# EAGLE schematic TSOC_RS485_EM (EAGLE 6.6.0)
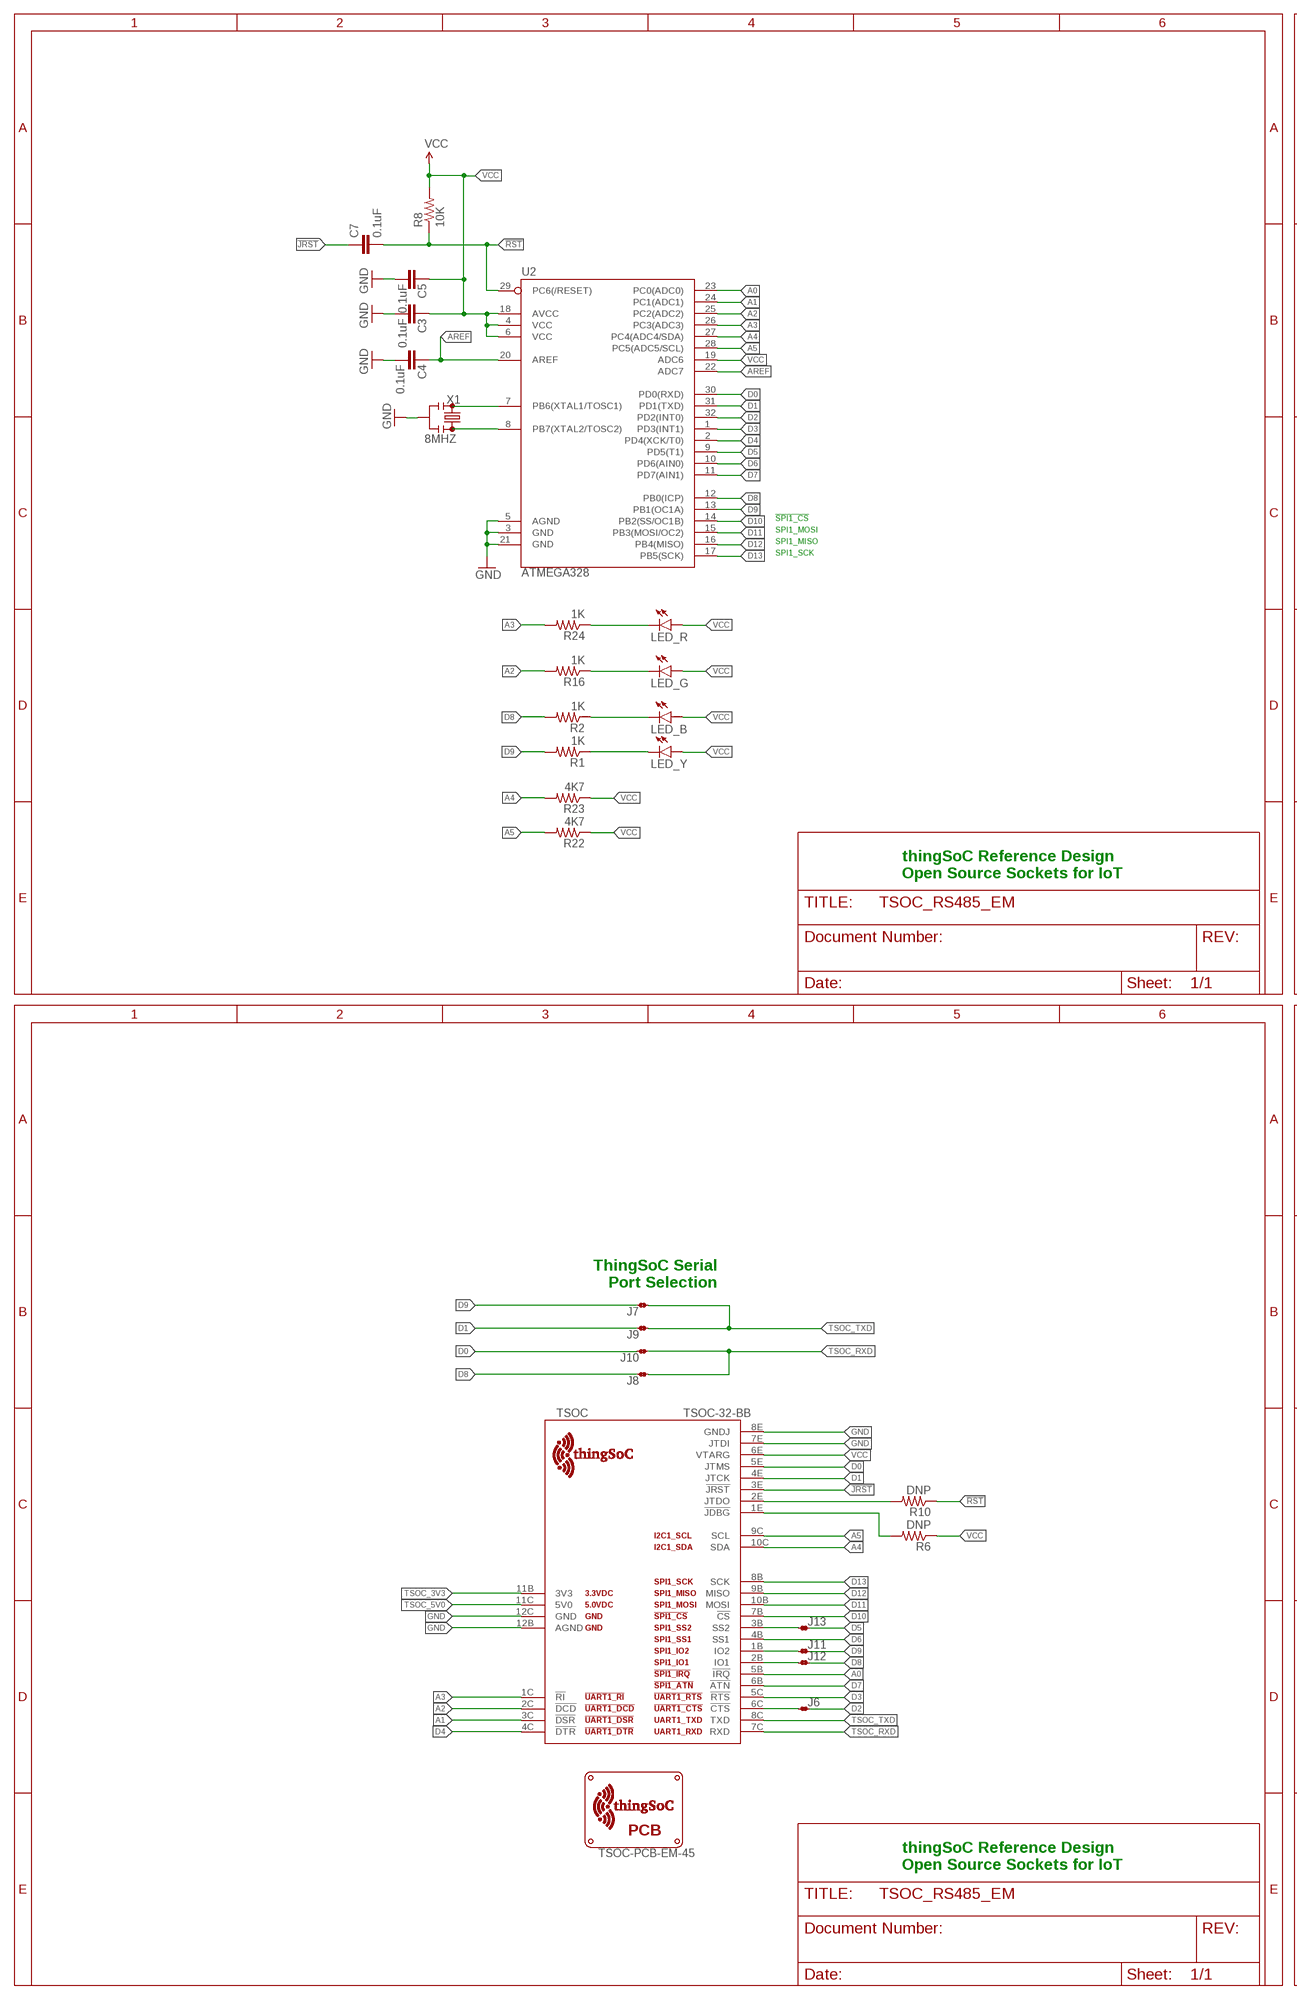
[diagram p0: schematic, sheet 1, part 1 of 2]
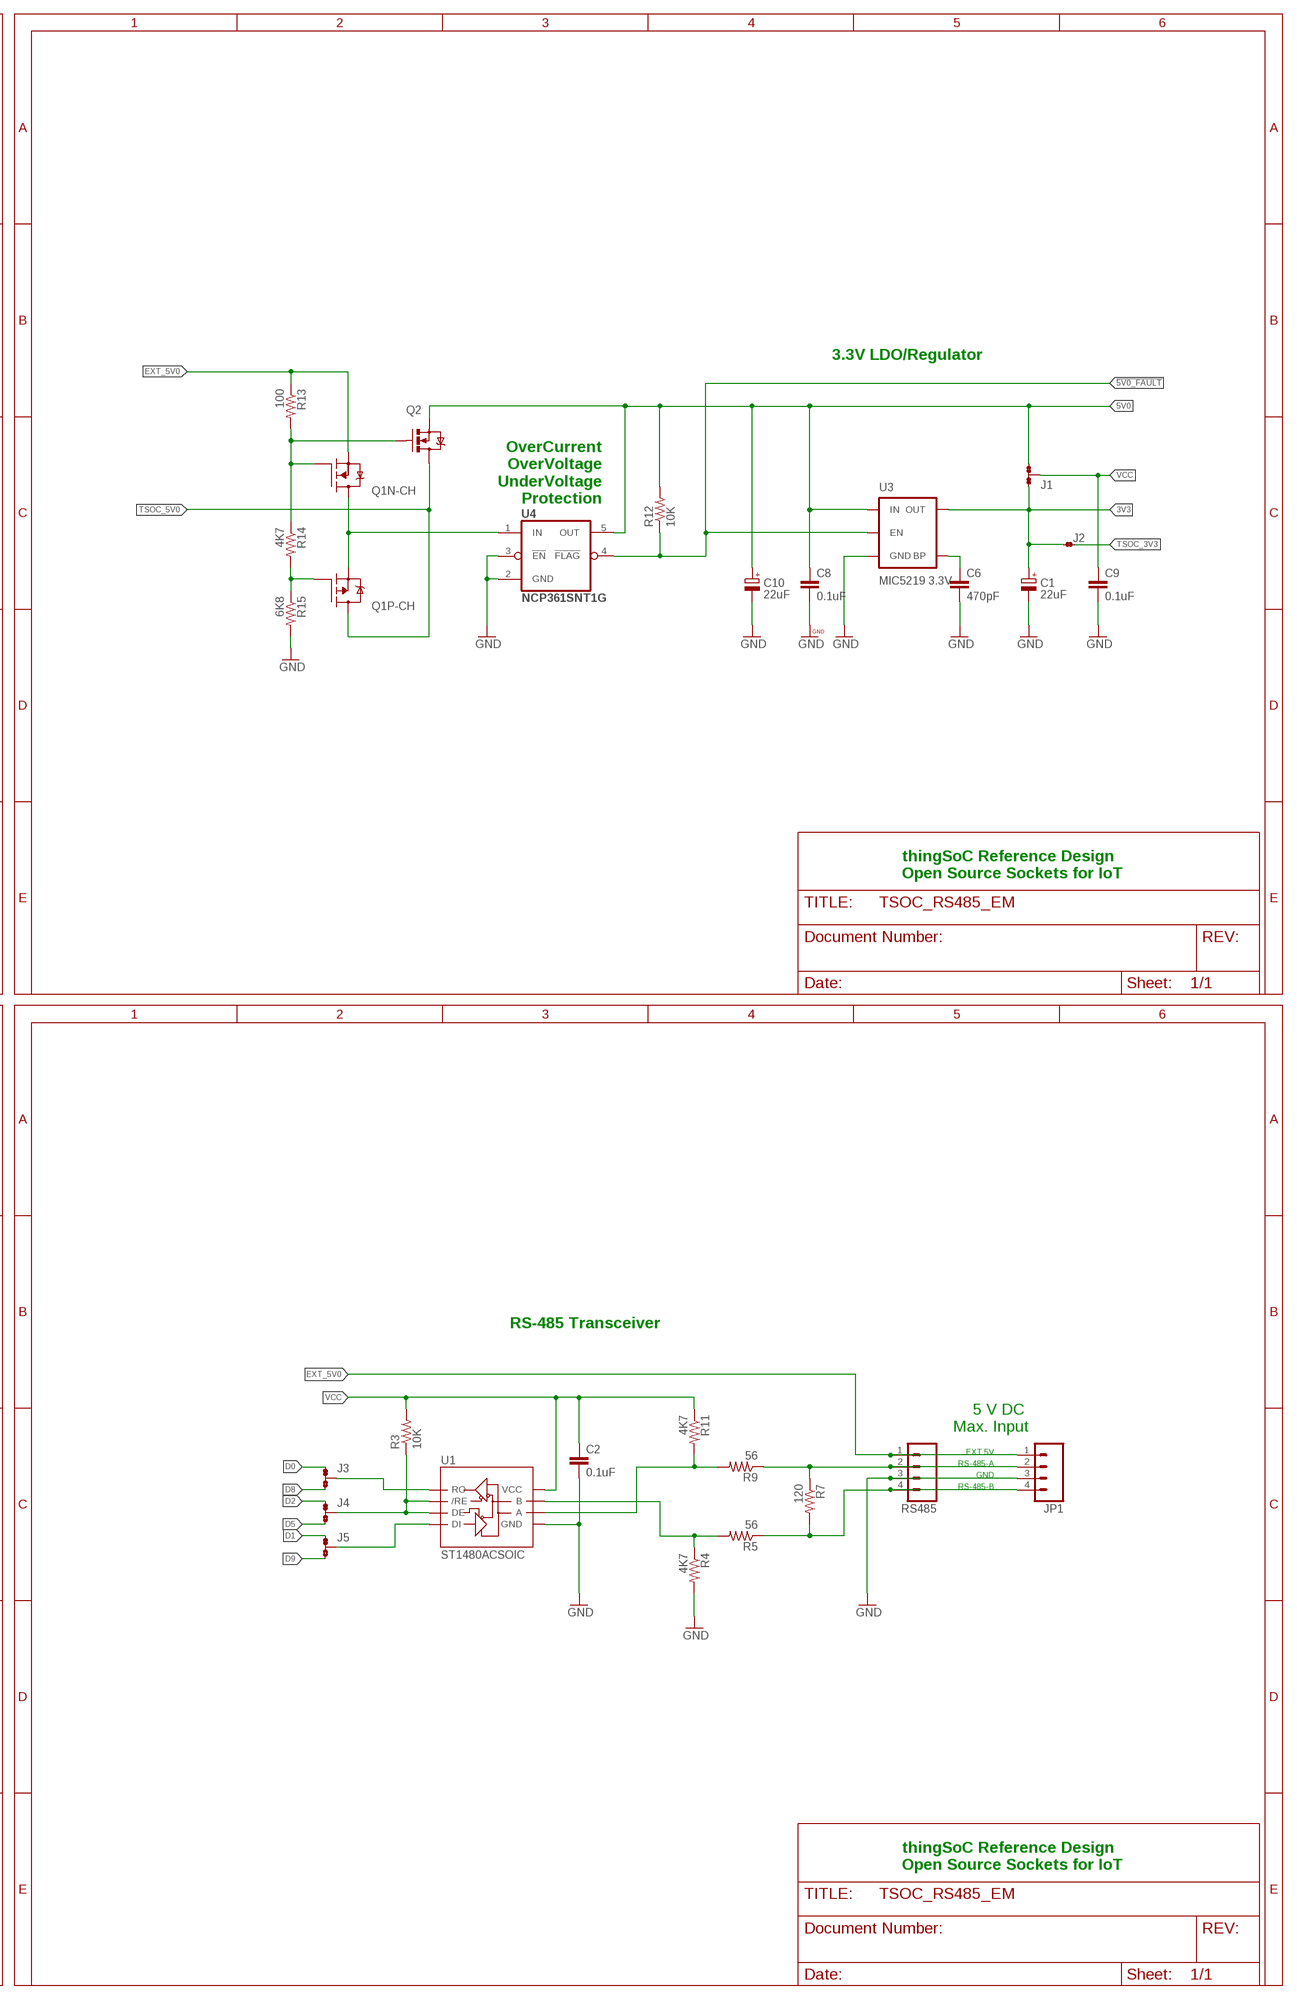
[diagram p1: schematic, sheet 1, part 2 of 2]

## Parts
C1  22uF  CPOL-EUSMCB  [SMC_B]
C2  0.1uF  CAP0402-CAP  [0402-CAP]
C3  0.1uF  CAP0402-CAP  [0402-CAP]
C4  0.1uF  CAP0402-CAP  [0402-CAP]
C5  0.1uF  CAP0402-CAP  [0402-CAP]
C6  470pF  CAP0402-CAP  [0402-CAP]
C7  0.1uF  CAP0402-CAP  [0402-CAP]
C8  0.1uF  CAP0402-CAP  [0402-CAP]
C9  0.1uF  CAP0402-CAP  [0402-CAP]
C10  22uF  CPOL-EUSMCB  [SMC_B]
J1  JMP-3-1_2  [JMP-3-1_2]
J2  JMP-2-NC  [JMP-2-NC]
J3  JMP-3-1_2  [JMP-3-1_2]
J4  JMP-3-1_2  [JMP-3-1_2]
J5  JMP-3-1_2  [JMP-3-1_2]
J6  JMP-2-NO  [JMP-2-NO]
J7  JMP-2-NO  [JMP-2-NO]
J8  JMP-2-NO  [JMP-2-NO]
J9  JMP-2-NO  [JMP-2-NO]
J10  JMP-2-NO  [JMP-2-NO]
J11  JMP-2-NC  [JMP-2-NC]
J12  JMP-2-NC  [JMP-2-NC]
J13  JMP-2-NC  [JMP-2-NC]
JP1  M04PTH  [1X04]
LED_B  LED0603  [LED-0603]
LED_G  LED0603  [LED-0603]
LED_R  LED0603  [LED-0603]
LED_Y  LED0603  [LED-0603]
Q1  FDC6420C  [SOT95P280X110-6N]
Q2  MOSFET-NCHANNELAO3404A  [SOT23-3]
R1  1K  RESISTOR0402  [0402-RES]
R2  1K  RESISTOR0402  [0402-RES]
R3  10K  RESISTOR0402  [0402-RES]
R4  4K7  RESISTOR0402  [0402-RES]
R5  56  RESISTOR0402  [0402-RES]
R6  DNP  RESISTOR0402  [0402-RES]
R7  120  RESISTOR0402  [0402-RES]
R8  10K  RESISTOR0402  [0402-RES]
R9  56  RESISTOR0402  [0402-RES]
R10  DNP  RESISTOR0402  [0402-RES]
R11  4K7  RESISTOR0402  [0402-RES]
R12  10K  RESISTOR0402  [0402-RES]
R13  100  RESISTOR0402  [0402-RES]
R14  4K7  RESISTOR0402  [0402-RES]
R15  6K8  RESISTOR0402  [0402-RES]
R16  1K  RESISTOR0402  [0402-RES]
R22  4K7  RESISTOR0402  [0402-RES]
R23  4K7  RESISTOR0402  [0402-RES]
R24  1K  RESISTOR0402  [0402-RES]
RS485  M04SCREW  [SCREWTERMINAL-3.5MM-4]
TSOC  TSOC-32-BB  [TSOC-BB-S32]
U1  ST1480ACSOIC  [SO08]
U2  ATMEGA328  ATMEGA168  [TQFP32-08]
U3  MIC5219 3.3V  V_REG_MIC52193.3V  [SOT23-5]
U4  NCP361SNT1G  [SOP95P275X110-5N]
U$1  TSOC-PCB-EM-45  [TSOC-EM-BB-45MM]
X1  8MHZ  RESONATOR8MHZ  [RESONATOR-SMD]

## Nets
3V3: C1.+ J1.1 J2.1 U3.5(OUT)
5V0: C8.1 C10.+ J1.3 Q2.2(S) R12.2 U3.1(IN) U4.5(OUT)
!5V0_FAULT: R12.1 U3.3(EN) U4.4(!FLAG)
!JDBG: R6.2 TSOC.1E(!JDBG)
!JRST: C7.1 TSOC.3E(!JRST)
!RST: C7.2 R8.1 R10.1 U2.29(PC6(/RESET))
A: R9.2 R11.2 U1.6(A)
A0: TSOC.5B(!IRQ) U2.23(PC0(ADC0))
A1: TSOC.3C(!DSR) U2.24(PC1(ADC1))
A2: R16.2 TSOC.2C(!DCD) U2.25(PC2(ADC2))
A3: R24.2 TSOC.1C(!RI) U2.26(PC3(ADC3))
A4: R23.2 TSOC.10C(SDA) U2.27(PC4(ADC4/SDA))
A5: R22.2 TSOC.9C(SCL) U2.28(PC5(ADC5/SCL))
AO: JP1.2 R7.1 R9.1 RS485.2
AREF: C4.2 U2.20(AREF) U2.22(ADC7)
B: R4.1 R5.2 U1.7(B)
BO: JP1.4 R5.1 R7.2 RS485.4
BYPASS1: C6.1 U3.4(BP)
D0: J3.1 J10.2 TSOC.5E(JTMS) U2.30(PD0(RXD))
D1: J5.1 J9.2 TSOC.4E(JTCK) U2.31(PD1(TXD))
D2: J4.1 J6.2 U2.32(PD2(INT0))
D3: TSOC.5C(!RTS) U2.1(PD3(INT1))
D4: TSOC.4C(!DTR) U2.2(PD4(XCK/T0))
D5: J4.3 J13.2 U2.9(PD5(T1))
D6: TSOC.4B(SS1) U2.10(PD6(AIN0))
D7: TSOC.6B(!ATN) U2.11(PD7(AIN1))
D8: J3.3 J8.2 J12.2 R2.2 U2.12(PB0(ICP))
D9: J5.3 J7.2 J11.2 R1.2 U2.13(PB1(OC1A))
D10: TSOC.7B(!CS) U2.14(PB2(SS/OC1B))
D11: TSOC.10B(MOSI) U2.15(PB3(MOSI/OC2))
D12: TSOC.9B(MISO) U2.16(PB4(MISO))
D13: TSOC.8B(SCK) U2.17(PB5(SCK))
DE: J4.2 R3.1 U1.2(/RE) U1.3(DE)
DI: J5.2 U1.4(DI)
EXT_5V0: JP1.1 Q1.5(N-CH:S) R13.1 RS485.1
GND: C1.- C2.2 C3.1 C4.1 C5.1 C6.2 C8.2 C9.2 C10.- JP1.3 R4.2 R15.2 RS485.3 TSOC.7E(JTDI) TSOC.8E(GNDJ) TSOC.12B(AGND) TSOC.12C(GND) U1.5(GND) U2.3(GND) U2.5(AGND) U2.21(GND) U3.2(GND) U4.2(GND) U4.3(!EN) X1.2
JTDO: R10.2 TSOC.2E(JTDO)
LEDB: LED_B.C R2.1
LEDG: LED_G.C R16.1
LEDR: LED_R.C R24.1
LEDY: LED_Y.C R1.1
N$1: J13.1 TSOC.3B(SS2)
NGATE: Q1.1(N-CH:G) Q2.1(G) R13.2 R14.1
PGATE: Q1.3(P-CH:G) R14.2 R15.1
RXD: J3.2 U1.1(RO)
TSOC_3V3: J2.2 TSOC.11B(3V3)
TSOC_5V0: Q1.4(P-CH:D) Q2.3(D) TSOC.11C(5V0)
TSOC_CTS: J6.1 TSOC.6C(!CTS)
TSOC_D8: J12.1 TSOC.2B(IO1)
TSOC_D9: J11.1 TSOC.1B(IO2)
TSOC_RXD: J8.1 J10.1 TSOC.7C(RXD)
TSOC_TXD: J7.1 J9.1 TSOC.8C(TXD)
VCC: C2.1 C3.2 C5.2 C9.1 J1.2 LED_B.A LED_G.A LED_R.A LED_Y.A R3.2 R6.1 R8.2 R11.1 R22.1 R23.1 TSOC.6E(VTARG) U1.8(VCC) U2.4(VCC) U2.6(VCC) U2.18(AVCC) U2.19(ADC6)
VIN: Q1.2(P-CH:S) Q1.6(N-CH:D) U4.1(IN)
XIN: U2.7(PB6(XTAL1/TOSC1)) X1.3
XOUT: U2.8(PB7(XTAL2/TOSC2)) X1.1

## Notes on the sheet
- 3.3V LDO/Regulator
- OverCurrent
  OverVoltage
  UnderVoltage
  Protection
- !SPI1_CS
- SPI1_MOSI
- SPI1_MISO
- SPI1_SCK
- thingSoC Reference Design
  Open Source Sockets for IoT
- thingSoC Reference Design
  Open Source Sockets for IoT
- ThingSoC Serial
  Port Selection
- RS-485 Transceiver
- 5 V DC 
  Max. Input
- EXT 5V
- RS-485-A
- GND
- RS-485-B
- thingSoC Reference Design
  Open Source Sockets for IoT
- thingSoC Reference Design
  Open Source Sockets for IoT

## Library data of the parts
C1 C10 = rcl:CPOL-EU: POLARIZED CAPACITOR, European symbol
C2-C9 = TSOC-MODBUS-ESM:CAP: Capacitor Standard 0603 ceramic capacitor, and 0.1" leaded capacitor.
J1 = PatternAgents-ProtoPads:JMP-3-1_2: Three Terminal Jumper - 1 & 2 Connected Positions 1and 2 are normally connected. PatternAgents ProtoPads Library Schematic and PCB layout libraries for design patterns by PatternAgents. For the CADSoft Eagle CAD program : http://www.cadsoftusa.com/download-eagle/ Source LBR : http://www.patternagents.com Github : https://github.com/PatternAgents License : http://creativecommons.org/licenses/by-sa/4.0/ (Creative Commons 4.0) THIS SOFTWARE IS PROVIDED BY THE CONTRIBUTORS "AS IS" AND WITHOUT ANY EXPRESS OR IMPLIED WARRANTIES, INCLUDING, BUT NOT LIMITED TO, THE IMPLIED WARRANTIES OF MERCHANTABILITY AND FITNESS FOR A PARTICULAR PURPOSE ARE DISCLAIMED. IN NO EVENT SHALL THE COPYRIGHT OWNER OR CONTRIBUTORS BE LIABLE FOR ANY DIRECT, INDIRECT, INCIDENTAL, SPECIAL, EXEMPLARY, OR CONSEQUENTIAL DAMAGES (INCLUDING, BUT NOT LIMITED TO, PROCUREMENT OF SUBSTITUTE GOODS OR SERVICES; LOSS OF USE, DATA, OR PROFITS; OR BUSINESS INTERRUPTION) HOWEVER CAUSED AND ON ANY THEORY OF LIABILITY, WHETHER IN CONTRACT, STRICT LIABILITY, OR TORT (INCLUDING NEGLIGENCE OR OTHERWISE) ARISING IN ANY WAY OUT OF THE USE OF THIS SOFTWARE, EVEN IF ADVISED OF THE POSSIBILITY OF SUCH DAMAGE.; BOM: EXCLUDE
J2 J11-J13 = TSOC-MODBUS-ESM:JMP-2-NC: Two Terminal Jumper - Normally Closed Positions 1 and 2 are normally connected. PatternAgents ProtoPads Library Schematic and PCB layout libraries for design patterns by PatternAgents. For the CADSoft Eagle CAD program : http://www.cadsoftusa.com/download-eagle/ Source LBR : http://www.patternagents.com Github : https://github.com/PatternAgents License : http://creativecommons.org/licenses/by-sa/4.0/ (Creative Commons 4.0) THIS SOFTWARE IS PROVIDED BY THE CONTRIBUTORS "AS IS" AND WITHOUT ANY EXPRESS OR IMPLIED WARRANTIES, INCLUDING, BUT NOT LIMITED TO, THE IMPLIED WARRANTIES OF MERCHANTABILITY AND FITNESS FOR A PARTICULAR PURPOSE ARE DISCLAIMED. IN NO EVENT SHALL THE COPYRIGHT OWNER OR CONTRIBUTORS BE LIABLE FOR ANY DIRECT, INDIRECT, INCIDENTAL, SPECIAL, EXEMPLARY, OR CONSEQUENTIAL DAMAGES (INCLUDING, BUT NOT LIMITED TO, PROCUREMENT OF SUBSTITUTE GOODS OR SERVICES; LOSS OF USE, DATA, OR PROFITS; OR BUSINESS INTERRUPTION) HOWEVER CAUSED AND ON ANY THEORY OF LIABILITY, WHETHER IN CONTRACT, STRICT LIABILITY, OR TORT (INCLUDING NEGLIGENCE OR OTHERWISE) ARISING IN ANY WAY OUT OF THE USE OF THIS SOFTWARE, EVEN IF ADVISED OF THE POSSIBILITY OF SUCH DAMAGE.; BOM: EXCLUDE
J3-J5 = TSOC_RS485_EM:JMP-3-1_2: Three Terminal Jumper - 1 & 2 Connected Positions 1and 2 are normally connected. PatternAgents ProtoPads Library Schematic and PCB layout libraries for design patterns by PatternAgents. For the CADSoft Eagle CAD program : http://www.cadsoftusa.com/download-eagle/ Source LBR : http://www.patternagents.com Github : https://github.com/PatternAgents License : http://creativecommons.org/licenses/by-sa/4.0/ (Creative Commons 4.0) THIS SOFTWARE IS PROVIDED BY THE CONTRIBUTORS "AS IS" AND WITHOUT ANY EXPRESS OR IMPLIED WARRANTIES, INCLUDING, BUT NOT LIMITED TO, THE IMPLIED WARRANTIES OF MERCHANTABILITY AND FITNESS FOR A PARTICULAR PURPOSE ARE DISCLAIMED. IN NO EVENT SHALL THE COPYRIGHT OWNER OR CONTRIBUTORS BE LIABLE FOR ANY DIRECT, INDIRECT, INCIDENTAL, SPECIAL, EXEMPLARY, OR CONSEQUENTIAL DAMAGES (INCLUDING, BUT NOT LIMITED TO, PROCUREMENT OF SUBSTITUTE GOODS OR SERVICES; LOSS OF USE, DATA, OR PROFITS; OR BUSINESS INTERRUPTION) HOWEVER CAUSED AND ON ANY THEORY OF LIABILITY, WHETHER IN CONTRACT, STRICT LIABILITY, OR TORT (INCLUDING NEGLIGENCE OR OTHERWISE) ARISING IN ANY WAY OUT OF THE USE OF THIS SOFTWARE, EVEN IF ADVISED OF THE POSSIBILITY OF SUCH DAMAGE.; BOM: EXCLUDE
J6-J10 = TSOC_RS485_EM:JMP-2-NO: Two Terminal Jumper - Normally Open Positions 1 and 2 are normally NOT connected. PatternAgents ProtoPads Library Schematic and PCB layout libraries for design patterns by PatternAgents. For the CADSoft Eagle CAD program : http://www.cadsoftusa.com/download-eagle/ Source LBR : http://www.patternagents.com Github : https://github.com/PatternAgents License : http://creativecommons.org/licenses/by-sa/4.0/ (Creative Commons 4.0) THIS SOFTWARE IS PROVIDED BY THE CONTRIBUTORS "AS IS" AND WITHOUT ANY EXPRESS OR IMPLIED WARRANTIES, INCLUDING, BUT NOT LIMITED TO, THE IMPLIED WARRANTIES OF MERCHANTABILITY AND FITNESS FOR A PARTICULAR PURPOSE ARE DISCLAIMED. IN NO EVENT SHALL THE COPYRIGHT OWNER OR CONTRIBUTORS BE LIABLE FOR ANY DIRECT, INDIRECT, INCIDENTAL, SPECIAL, EXEMPLARY, OR CONSEQUENTIAL DAMAGES (INCLUDING, BUT NOT LIMITED TO, PROCUREMENT OF SUBSTITUTE GOODS OR SERVICES; LOSS OF USE, DATA, OR PROFITS; OR BUSINESS INTERRUPTION) HOWEVER CAUSED AND ON ANY THEORY OF LIABILITY, WHETHER IN CONTRACT, STRICT LIABILITY, OR TORT (INCLUDING NEGLIGENCE OR OTHERWISE) ARISING IN ANY WAY OUT OF THE USE OF THIS SOFTWARE, EVEN IF ADVISED OF THE POSSIBILITY OF SUCH DAMAGE.; BOM: EXCLUDE
JP1 = TSOC_RS485_EM:M04: Header 4 Standard 4-pin 0.1" header. Use with straight break away headers (SKU : PRT-00116), right angle break away headers (PRT-00553), swiss pins (PRT-00743), machine pins (PRT-00117), and female headers (PRT-00115). Molex polarized connector foot print use with SKU : PRT-08231 with associated crimp pins and housings. 1MM SMD Version SKU: PRT-10208
LED_B LED_G LED_R LED_Y = TSOC-MODBUS-ESM:LED: LEDs Standard schematic elements and footprints for 5mm, 3mm, 1206, and 0603 sized LEDs. 5mm - Spark Fun Electronics SKU : COM-00529 (and others)
Q1 = TSOC-ESP8266-BASE:FDC6420C: N and P Channel Power Trench MOSFETs
Q2 = SparkFun-DiscreteSemi:MOSFET-NCHANNEL: Common NMOSFET Parts MFG P/N Store ID Prod ID FDD8780 TRANS-09984 SI7820DN TRANS-11055 FDS6630A IC-08089 2N7002PW TRANS-11151 FQP30N06L COM-10213 TRANS-10060 BSS123LT1G TRANS-08345 BSS138 TRANS-00830 BS170 2N7000; PROD_ID: TRAN-12988
R1-R16 R22-R24 = TSOC-MODBUS-ESM:RESISTOR: Resistor Basic schematic elements and footprints for 0603, 1206, and PTH resistors.
RS485 = TSOC_RS485_EM:M04: Header 4 Standard 4-pin 0.1" header. Use with straight break away headers (SKU : PRT-00116), right angle break away headers (PRT-00553), swiss pins (PRT-00743), machine pins (PRT-00117), and female headers (PRT-00115). Molex polarized connector foot print use with SKU : PRT-08231 with associated crimp pins and housings. 1MM SMD Version SKU: PRT-10208; PROD_ID: Combine 2x8399
TSOC = thingSoC:TSOC-32: thingSoC Thirty-Two (32) Pin Socket Source LBR : http://www.thingsoc.com Github : https://github.com/thingsoc License : http://creativecommons.org/licenses/by-sa/4.0/ (Creative Commons 4.0) THIS SOFTWARE IS PROVIDED BY THE CONTRIBUTORS "AS IS" AND WITHOUT ANY EXPRESS OR IMPLIED WARRANTIES, INCLUDING, BUT NOT LIMITED TO, THE IMPLIED WARRANTIES OF MERCHANTABILITY AND FITNESS FOR A PARTICULAR PURPOSE ARE DISCLAIMED. IN NO EVENT SHALL THE COPYRIGHT OWNER OR CONTRIBUTORS BE LIABLE FOR ANY DIRECT, INDIRECT, INCIDENTAL, SPECIAL, EXEMPLARY, OR CONSEQUENTIAL DAMAGES (INCLUDING, BUT NOT LIMITED TO, PROCUREMENT OF SUBSTITUTE GOODS OR SERVICES; LOSS OF USE, DATA, OR PROFITS; OR BUSINESS INTERRUPTION) HOWEVER CAUSED AND ON ANY THEORY OF LIABILITY, WHETHER IN CONTRACT, STRICT LIABILITY, OR TORT (INCLUDING NEGLIGENCE OR OTHERWISE) ARISING IN ANY WAY OUT OF THE USE OF THIS SOFTWARE, EVEN IF ADVISED OF THE POSSIBILITY OF SUCH DAMAGE.
U1 = TSOC-MODBUS-ESM:ST1480AC: ST Microelectronics ST1480AC RS-485/RS-422 Transceiver Source : http://www.st.com/web/en/resource/technical/document/datasheet/CD00003136.pdf The ST1480Ax is ±15 kV ESD protected, 3.3 V low power transceiver for RS-485 and RS-422 communications. The device contains one driver and one receiver in half duplex configuration. The ST1480Ax transmits and receives at a guaranteed data rate of at least 12 Mbps. All transmitter outputs and receiver inputs are protected to ±15 kV using Human Body Model. Driver is short-circuit current limited and is protected against excessive power dissipation by thermal shutdown circuitry that places the driver outputs into a high-impedance state. The ST1480Ax input has a true fail-safe feature that guarantees a logic high output if both inputs are open circuit, shorted together or in the presence of a termination with no signal on the bus.
U2 = SparkFun:ATMEGA168
U3 = TSOC-ESP8266-BASE:V_REG_MIC5219: V_REG MIC5219 Standard 3.3V and 5V 500mA LDO voltage regulator in SOT-23 layout. Micrel part MIC5219. BP (by-pass) pin is used to lower output noise with 470pF cap, may be left open.; PROD_ID: VREG-09872
U4 = TSOC-ESP8266-BASE:NCP361SNT1G: USB Positive Overvoltage Protection Controller; MPN: NCP361SNT1G; OC_FARNELL: 1642242; OC_NEWARK: 01P0135; PACKAGE: TSOP-5; SUPPLIER: ON Semiconductor
U$1 = TSOC_RS485_EM:TSOC-PCB: thingSoC PCB Outlines Boards Outlines for Standard Sizes (in the DImension Layer) (Registration marks in the tDocu layer - make sure to turn on tDocu/bDocu) Source LBR : http://www.thingsoc.com Github : https://github.com/thingsoc License : http://creativecommons.org/licenses/by-sa/4.0/ (Creative Commons 4.0) THIS SOFTWARE IS PROVIDED BY THE CONTRIBUTORS "AS IS" AND WITHOUT ANY EXPRESS OR IMPLIED WARRANTIES, INCLUDING, BUT NOT LIMITED TO, THE IMPLIED WARRANTIES OF MERCHANTABILITY AND FITNESS FOR A PARTICULAR PURPOSE ARE DISCLAIMED. IN NO EVENT SHALL THE COPYRIGHT OWNER OR CONTRIBUTORS BE LIABLE FOR ANY DIRECT, INDIRECT, INCIDENTAL, SPECIAL, EXEMPLARY, OR CONSEQUENTIAL DAMAGES (INCLUDING, BUT NOT LIMITED TO, PROCUREMENT OF SUBSTITUTE GOODS OR SERVICES; LOSS OF USE, DATA, OR PROFITS; OR BUSINESS INTERRUPTION) HOWEVER CAUSED AND ON ANY THEORY OF LIABILITY, WHETHER IN CONTRACT, STRICT LIABILITY, OR TORT (INCLUDING NEGLIGENCE OR OTHERWISE) ARISING IN ANY WAY OUT OF THE USE OF THIS SOFTWARE, EVEN IF ADVISED OF THE POSSIBILITY OF SUCH DAMAGE.
X1 = TSOC_RS485_EM:RESONATOR: Resonator Small SMD resonator. Used, eg, on the Arduino Pro/ Pro Mini boards. 8MHz- XTAL-08895 16MHz- XTAL-08900; PROD_ID: XTAL-08895

## Net classes
1 vcc: width 0.254 mm